# Altium schematic sheet USB_Controller.SchDoc
size A
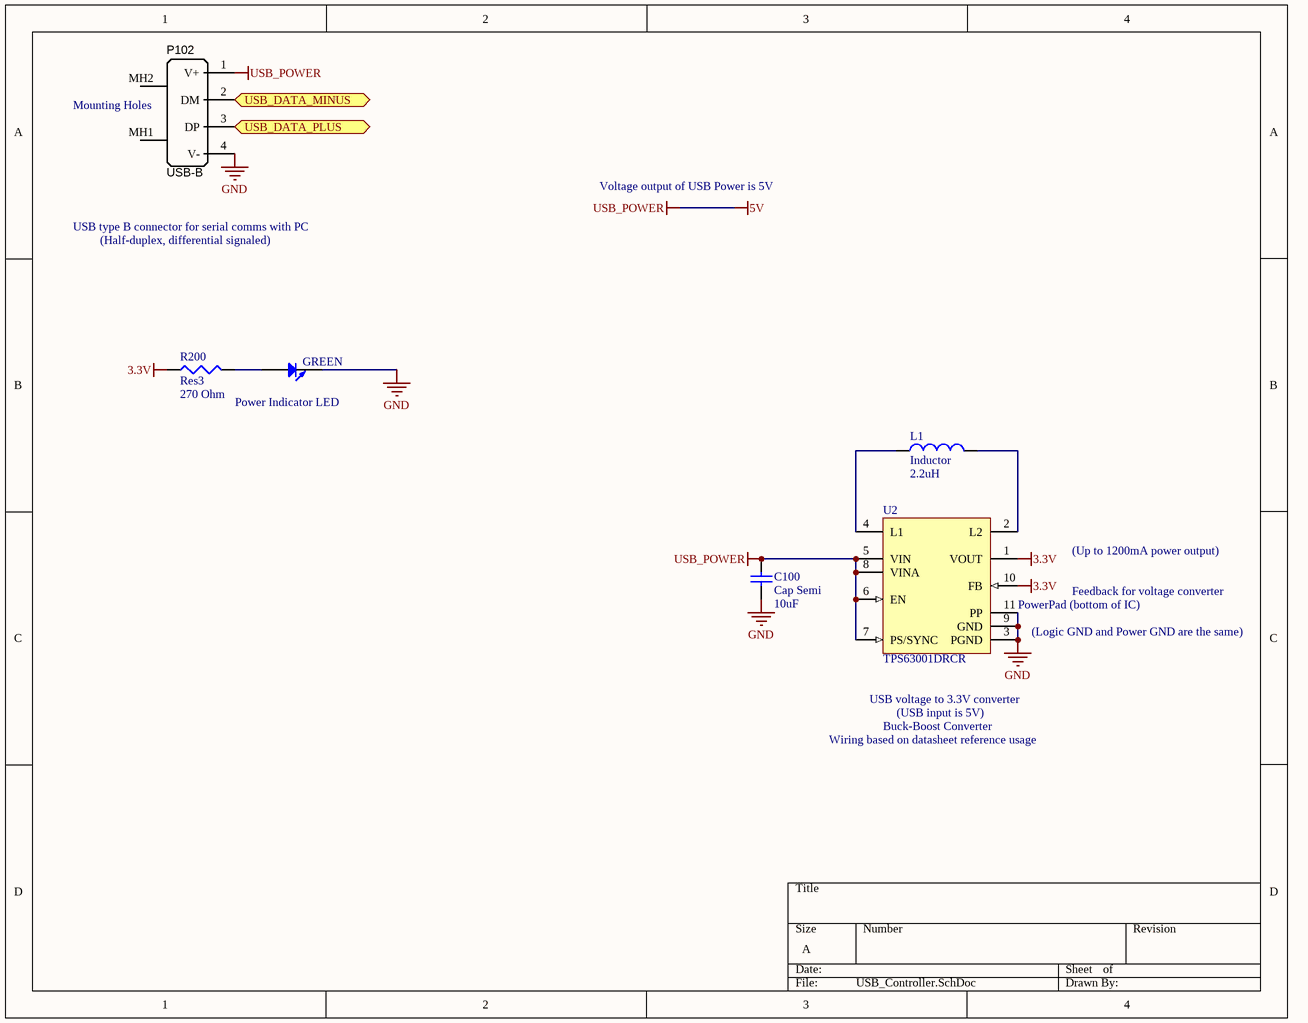
[diagram p0: USB_Controller.SchDoc]

## Parts
C100  Cap Semi  value 10uF  [1608[0603]]
L1  Inductor  value 2.2uH  [INDC3216]
LED1  GREEN  [1608[0603]]
P102  USB-B  [USB_TypeB_Tyco]
R200  Res3  value 270 Ohm  [1608[0603]]
U2  TPS63001DRCR  [DRC10-2400X1650TP]

## Ports
USB_DATA_MINUS, USB_DATA_PLUS

## Nets
3.3V: R200.1 U2.1(VOUT) U2.10(FB)
5V: C100.2 P102.1(V+) U2.5(VIN) U2.6(EN) U2.7(PS/SYNC) U2.8(VINA)  [also labelled USB_POWER]
GND: C100.1 LED1.2(K) P102.4(V-) U2.3(PGND) U2.9(GND) U2.11(PP)
USB_DATA_MINUS: P102.2(DM) ; port USB_DATA_MINUS
USB_DATA_PLUS: P102.3(DP) ; port USB_DATA_PLUS
NetL1_1: L1.1 U2.4(L1)
NetL1_2: L1.2 U2.2(L2)
NetLED1_1: LED1.1(A) R200.2

Not connected (* = marked no-connect by the designer): P102 MH1(Shell) MH2(Shell)

## Notes on the sheet
- (near P102) Mounting Holes
- USB type B connector for serial comms with PC
- Voltage output of USB Power is 5V
- (Half-duplex, differential signaled)
- Power Indicator LED
- (Up to 1200mA power output)
- (near U2) PowerPad (bottom of IC)
- (near U2) (Logic GND and Power GND are the same)
- Feedback for voltage converter
- USB voltage to 3.3V converter
- Wiring based on datasheet reference usage
- Buck-Boost Converter
- (USB input is 5V)

## Library data of the parts
C100 = Cap Semi: Capacitor (Semiconductor SIM Model); Published: 8-Jun-2000; LatestRevisionDate: 29-May-2009; LatestRevisionNote: IPC-7351 Footprint Added.; PackageReference: C1206; Publisher: Altium Limited; PackageDescription: Chip Capacitor
L1 = Inductor: Code_IEC: 1005; Published: 8-Jun-2000; LatestRevisionDate: 29-May-2009; LatestRevisionNote: IPC-7351 Footprint Added.; PackageReference: 0402-A; Publisher: Altium Limited; PackageDescription: Chip Inductor; Code_JEITA: 0402
LED1 = LED0: led; Manufacturer: Lite-On Inc; Manufacturer Part Number: LTST-C193KGKT-5A; Wavelength - Dominant: 572nm; Wavelength - Peak: 574nm; Millicandela Rating: 16.25mcd; Voltage - Forward (Vf) (Typ): 2V; Current - Test: 5mA; Viewing Angle: 130°; Lens Type: Clear; Lens Style/Size: Rectangle with Flat Top, 1.15mm x 0.8mm; Supplier 1: Digi-Key; Supplier Part Number 1: 160-1828-1-ND; RoHS: RoHS Compliant; Category: Optoelectronics; Stock 1: 69140; Pricing 1: 1=0.43, 10=0.315, 100=0.167, 250=0.11812, 500=0.1008, 1000=0.07875 (USD); Packaging: Cut Tape (CT); Color: Green; Package / Case: 0603 (1608 Metric); Size / Dimension: 1.60mm L x 0.80mm W; Height: 0.35mm; Mounting Type: Surface Mount; Luminous Flux @ Current - Test: -; ComponentLink1URL: http://optoelectronics.liteon.com/upload/download/DS22-2007-0094/S_110_LTST-C193KGKT-5A.pdf; ComponentLink1Description: http://optoelectronics.liteon.com/upload/download/DS22-2007-0094/S_110_LTST-C193KGKT-5A.pdf
P102 = USB_TypeB: Connector THT Type B USB connector; Manufacturer Part Number 1: 292304-1; Manufacturer 1: TE Connectivity; Specifications: USB 2.0; SCDType: undef; Package / Case: R/A Type B; Supplier 1: Digi-Key; Connector Type: USB - B; Supplier Part Number 1: A31725-ND
R200 = Res3: Resistor; Published: 8-Jun-2000; LatestRevisionDate: 29-May-2009; LatestRevisionNote: IPC-7351 Footprint Added.; PackageReference: J1-0603; Publisher: Altium Limited; PackageDescription: Chip Resistor
U2 = TPS63001DRCR: Buck-Boost Voltage Converter with 1.8 to 5.5 V Input and 3.3 V Output, -40 to 85 degC, 10-Pin SON (DRC), Green (RoHS & no Sb/Br); Manufacturer: Texas Instruments; Dynamic Voltage Scaling: TRUE; Iout(Max)(A): 1.2; Iq(Typ)(mA): 0.03; Preset Vout(V): 3.3; Regulated Outputs(#): 1; SubFamily: Buck-Boost Regulator; Switching Frequency(Max)(kHz): 1500; Vin(Max)(V): 5.5; Vin(Min)(V): 1.8; DatasheetVersion: SLVS520B; PackageVersion: revL, Sep-2011; PackageReference: DRC10-2400X1650TP; PackageDescription: 10-Pin Plastic Small Outline No-Lead, 3 x 3 x 1 mm Body, 0.5 mm Pitch, Exposed Pad; Supplier 1: Digi-Key; Supplier Part Number 1: 296-19643-2-ND; Supplier 2: Digi-Key; Supplier Part Number 2: 296-19643-1-ND; Supplier 3: Digi-Key; Supplier Part Number 3: 296-19643-6-ND; Supplier 4: Farnell; Supplier Part Number 4: 1412595; Supplier 5: Newark; Supplier Part Number 5: 85K1711; Supplier 6: Mouser; Supplier Part Number 6: 595-TPS63001DRCR; Eco-Plan: Green (RoHS & no Sb/Br); Synchronous Rectification: TRUE; Topology: Buck-Boost; Vout(Max)(V): 3.3; Vout(Min)(V): 3.3; Mounting Technology: Surface Mount; PartNumber: TPS63001DRCR; ComponentLink1Description: Datasheet; ComponentLink1URL: http://www.ti.com/general/docs/lit/getliterature.tsp?genericPartNumber=TPS63001&fileType=pdf; ComponentLink2Description: Package Specification; ComponentLink2URL: http://www.ti.com/litv/pdf/mpds117k